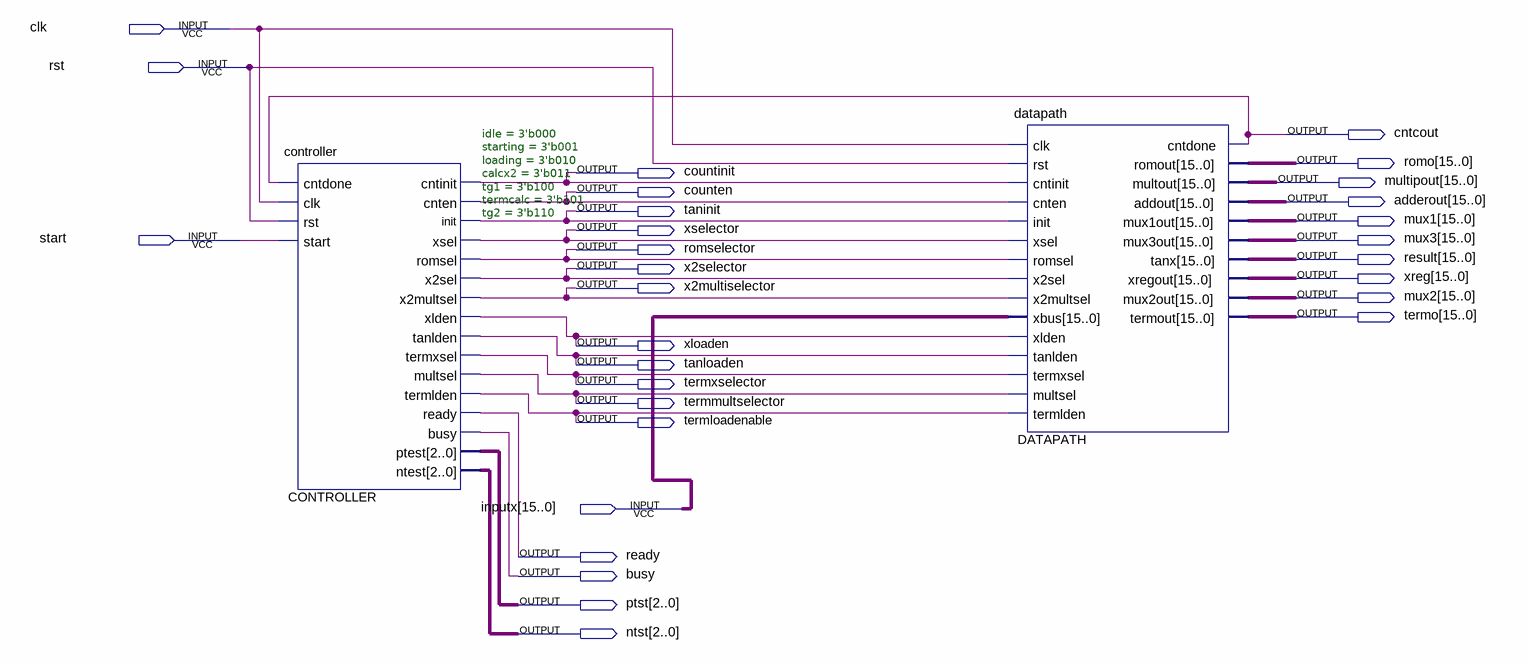
[diagram p0: schematic sheet]
// Quartus schematic ca6.bdf as structural Verilog: 2 symbols, 30 pins
module ca6 (
  input  clk,
  input  rst,
  input  start,
  input  [15:0] inputx,
  output cntcout,
  output [15:0] romo,
  output countinit,
  output [15:0] multipout,
  output counten,
  output [15:0] adderout,
  output taninit,
  output [15:0] mux1,
  output xselector,
  output [15:0] mux3,
  output romselector,
  output [15:0] result,
  output x2selector,
  output [15:0] xreg,
  output x2multiselector,
  output [15:0] mux2,
  output [15:0] termo,
  output xloaden,
  output tanloaden,
  output termxselector,
  output termmultselector,
  output termloadenable,
  output ready,
  output busy,
  output [2:0] ptst,
  output [2:0] ntst
);

  controller #(.idle(3'b000), .starting(3'b001), .loading(3'b010), .calcx2(3'b011), .tg1(3'b100), .termcalc(3'b101), .tg2(3'b110)) CONTROLLER (
    .cntdone(cntcout), .clk(clk), .rst(rst), .start(start), .cntinit(countinit), .cnten(counten),
    .init(taninit), .xsel(xselector), .romsel(romselector), .x2sel(x2selector), .x2multsel(x2multiselector),
    .xlden(xloaden), .tanlden(tanloaden), .termxsel(termxselector), .multsel(termmultselector),
    .termlden(termloadenable), .ready(ready), .busy(busy), .ptest(ptst), .ntest(ntst));
  datapath DATAPATH (
    .clk(clk), .rst(rst), .cntinit(countinit), .cnten(counten), .init(taninit), .xsel(xselector),
    .romsel(romselector), .x2sel(x2selector), .x2multsel(x2multiselector), .xbus(inputx), .xlden(xloaden),
    .tanlden(tanloaden), .termxsel(termxselector), .multsel(termmultselector), .termlden(termloadenable),
    .cntdone(cntcout), .romout(romo), .multout(multipout), .addout(adderout), .mux1out(mux1), .mux3out(mux3),
    .tanx(result), .xregout(xreg), .mux2out(mux2), .termout(termo));
endmodule
